# EAGLE design Sensors_v2 (EAGLE 9.3.1)
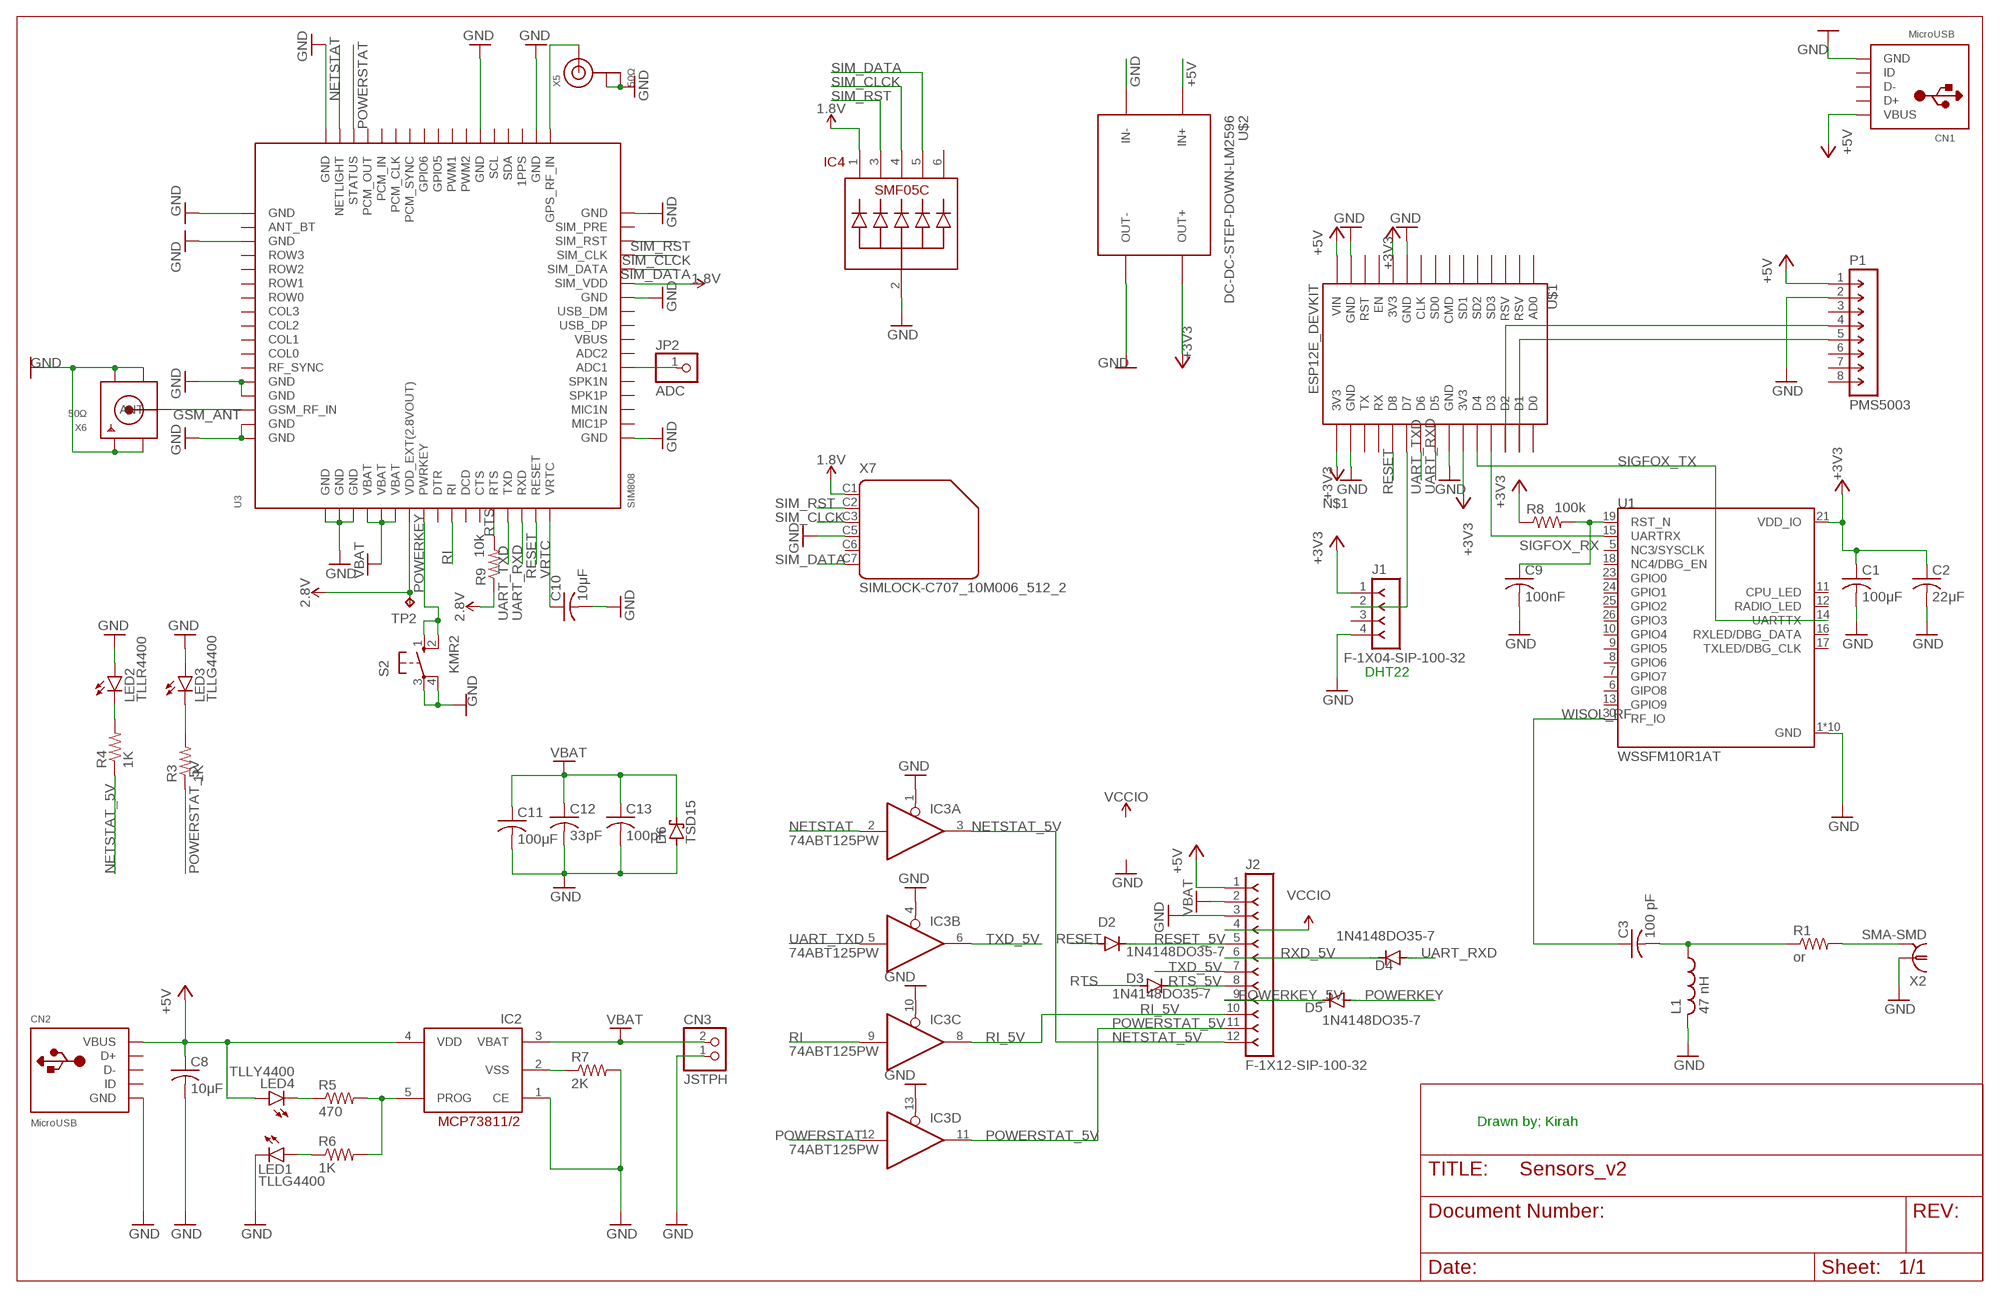
[diagram p0: schematic, sheet 1]

## Parts
C1  100μF  C-USC0201  [C0201]
C2  22μF  C-USC0201  [C0201]
C3  100 pF  C-USC0201  [C0201]
C8  10μF  C-US025-025X050  [C025-025X050]
C9  100nF  C-US025-025X050  [C025-025X050]
C10  10μF  C-USC0402  [C0402]
C11  100μF  C-USC0402  [C0402]
C12  33pF  C-USC0402  [C0402]
C13  100pF  C-USC0402  [C0402]
CN1  MicroUSB  USBMINIB  [USB-MINIB]
CN2  MicroUSB  USBMINIB  [USB-MINIB]
CN3  JSTPH  JST_2PIN-SMT  [JST-PH-2-SMT]
D2  1N4148DO35-7  [DO35-7]
D3  1N4148DO35-7  [DO35-7]
D4  1N4148DO35-7  [DO35-7]
D5  1N4148DO35-7  [DO35-7]
D6  TSD15  [CB429-15]
IC2  MCP73811/2  [SOT23-5L]
IC3  74ABT125PW  [TSSOP14]
IC4  SMF05C  [SC-70-6]
J1  F-1X04-SIP-100-32  [SIP-100-04-32]
J2  F-1X12-SIP-100-32  [SIP-100-12-32]
JP2  ADC  PINHD-1X01_2.00  [1X01M]
L1  47 nH  L-US0204/7  [0204/7]
LED1  TLLG4400  [LED3MM]
LED2  TLLR4400  [LED3MM]
LED3  TLLG4400  [LED3MM]
LED4  TLLY4400  [LED3MM]
P1  PMS5003  M-1X08-SIP-100-40  [SIP-100-08-40]
R1  or  R-US_0204/5  [0204/5]
R3  1K  R-US_0204/5  [0204/5]
R4  1K  R-US_0204/5  [0204/5]
R5  470  R-US_0204/5  [0204/5]
R6  1K  R-US_0204/5  [0204/5]
R7  2K  R-US_0204/5  [0204/5]
R8  100k  R-US_0204/7  [0204/7]
R9  10k  R-US_0204/5  [0204/5]
S2  KMR2  40/XX  [B3F/40XX]
TP2  TPTP10R  [TP10R]
U1  WSSFM10R1AT  [XCVR_WSSFM10R1AT]
U3  SIM808  GSM_SIM808_LITERAL  [SIM900_SMT]
U$1  ESP12E_DEVKIT  [ESP12E_DEVKIT]
U$2  DC-DC-STEP-DOWN-LM2596  [DC-DC-STEP-DOWN-LM2596]
X2  SMA-SMD  [SMA-SMD]
X5  50Ω  ANTENNA_U.FL  [U.FL]
X6  50Ω  SMACONNECTOR_EDGE_UFL  [SMA_EDGELAUNCH_UFL]
X7  SIMLOCK-C707_10M006_512_2  [C707_10M006_512_2]

## Nets
1.8V [POWER]: IC4.1 U3.P$29(SIM_VDD) X7.C1
2.8V [POWER]: R9.1 TP2.TP U3.P$7(VDD_EXT(2.8VOUT))
+3V3 [POWER]: C1.1 C2.1 J1.1 R8.1 U1.21(VDD_IO) U$1.3V3@0(3V3) U$1.3V3@1(3V3) U$1.3V3@2(3V3) U$2.OUT+
+5V [POWER]: C8.1 CN1.VBUS CN2.VBUS IC2.4(VDD) J2.1 LED4.A P1.1 U$1.VIN U$2.IN+
GND [GND]: C1.2 C2.2 C8.2 C9.2 C10.2 C11.2 C12.2 C13.2 CN1.GND CN2.GND CN3.1 D6.A IC2.1(CE) IC3.1(A:OE) IC3.4(B:OE) IC3.10(C:OE) IC3.13(D:OE) IC4.2 J1.4 J2.3 L1.2 LED1.K(C) LED2.A LED3.A P1.2 R7.2 S2.3(P) S2.4(P1) U1.1(GND) U1.2(GND) U1.3(GND) U1.4(GND) U1.20(GND) U1.22(GND) U1.27(GND) U1.28(GND) U1.29(GND) U1.31(GND) U3.P$1(GND) U3.P$2(GND) U3.P$3(GND) U3.P$18(GND) U3.P$28(GND) U3.P$34(GND) U3.P$36(GND) U3.P$40(GND) U3.P$51(GND) U3.P$52(GND) U3.P$54(GND) U3.P$64(GND) U3.P$65(GND) U3.P$67(GND) U3.P$68(GND) U$1.GND@0(GND) U$1.GND@1(GND) U$1.GND@2(GND) U$1.GND@3(GND) U$2.IN- U$2.OUT- X2.1 X5.1(GND) X5.2(GND) X6.GND@1(GND1) X6.GND@2(GND2) X6.GND@3(GND3) X6.GND@4(GND4) X7.C5
GSM_ANT: U3.P$66(GSM_RF_IN) X6.P(ANT)
N$1: J1.2 U$1.D7
N$2: C9.1 R8.2 U1.19(RST_N)
N$3: P1.4 U$1.D2
N$4: P1.5 U$1.D1
N$5: C3.2 L1.1 R1.1
N$6: U3.P$35(GPS_RF_IN) X5.3(SIGNAL)
N$12: R1.2 X2.2@1 X2.2@2 X2.2@3 X2.2@4 X2.2@5 X2.2@6
N$13: JP2.1 U3.P$23(ADC1)
N$18: LED2.K(C) R4.2
N$21: LED3.K(C) R3.2
N$35: LED4.K(C) R5.1
N$36: IC2.5(PROG) R5.2 R6.2
N$37: LED1.A R6.1
NETSTAT: IC3.2(A:I) U3.P$50(NETLIGHT)
NETSTAT_5V: IC3.3(A:O) J2.12 R4.1
POWERKEY: D5.A S2.1(S) S2.2(S1) U3.P$8(PWRKEY)
POWERKEY_5V: D5.C J2.9
POWERSTAT: IC3.12(D:I) U3.P$49(STATUS)
POWERSTAT_5V: IC3.11(D:O) J2.11 R3.1
RESET: D2.A U3.P$16(RESET) U$1.D8
RESET_5V: D2.C J2.5
RI: IC3.9(C:I) U3.P$10(RI)
RI_5V: IC3.8(C:O) J2.10
RTS: D3.A R9.2 U3.P$13(RTS)
RTS_5V: D3.C J2.8
RXD_5V: D4.C J2.6
SIGFOX_RX: U1.15(UARTRX) U$1.D3
SIGFOX_TX: U1.14(UARTTX) U$1.D4
SIM_CLCK: IC4.4 U3.P$31(SIM_CLK) X7.C3
SIM_DATA: IC4.5 U3.P$30(SIM_DATA) X7.C7
SIM_RST: IC4.3 U3.P$32(SIM_RST) X7.C2
TXD_5V: IC3.6(B:O) J2.7
UART_RXD: D4.A U3.P$15(RXD) U$1.D5
UART_TXD: IC3.5(B:I) U3.P$14(TXD) U$1.D6
VBAT: C11.1 C12.1 C13.1 CN3.2 D6.C IC2.3(VBAT) J2.2 U3.P$4(VBAT) U3.P$5(VBAT) U3.P$6(VBAT)
VCCIO: J2.4
VRTC: C10.1 U3.P$17(VRTC)
VSS: IC2.2(VSS) R7.1
WISOL_RF: C3.1 U1.30(RF_IO)
Unconnected: CN1.D+ CN1.D- CN1.ID CN2.D+ CN2.D- CN2.ID IC4.6 J1.3 P1.3 P1.6 P1.7 P1.8 U1.5(NC3/SYSCLK) U1.6(GIPO8) U1.7(GPIO7) U1.8(GPIO6) U1.9(GPIO5) U1.10(GPIO4) U1.11(CPU_LED) U1.12(RADIO_LED) U1.13(GPIO9) U1.16(RXLED/DBG_DATA) U1.17(TXLED/DBG_CLK) U1.18(NC4/DBG_EN) U1.23(GPIO0) U1.24(GPIO1) U1.25(GPIO2) U1.26(GPIO3) U3.P$9(DTR) U3.P$11(DCD) U3.P$12(CTS) U3.P$19(MIC1P) U3.P$20(MIC1N) U3.P$21(SPK1P) U3.P$22(SPK1N) U3.P$24(ADC2) U3.P$26(USB_DP) U3.P$27(USB_DM) U3.P$33(SIM_PRE) U3.P$37(1PPS) U3.P$38(SDA) U3.P$39(SCL) U3.P$41(PWM2) U3.P$42(PWM1) U3.P$43(GPIO5) U3.P$44(GPIO6) U3.P$45(PCM_SYNC) U3.P$46(PCM_CLK) U3.P$47(PCM_IN) U3.P$48(PCM_OUT) U3.P$53(ANT_BT) U3.P$55(ROW3) U3.P$56(ROW2) U3.P$57(ROW1) U3.P$58(ROW0) U3.P$59(COL3) U3.P$60(COL2) U3.P$61(COL1) U3.P$62(COL0) U3.P$63(RF_SYNC) U$1.AD0 U$1.CLK U$1.CMD U$1.D0 U$1.EN U$1.RST U$1.RSV@0(RSV) U$1.RSV@1(RSV) U$1.RX U$1.SD0 U$1.SD1 U$1.SD2 U$1.SD3 U$1.TX X7.C6

## Notes on the sheet
- DHT22
- Drawn by; Kirah

## Power pins joined to a net without a drawn wire
GND: IC3.7(P:GND)
VBUS: U3.P$25(VBUS)
VCC: IC3.14(P:VCC)

## Library data of the parts
C1-C3 C9-C13 = rcl:C-US: CAPACITOR, American symbol; SPICEPREFIX: C
C8 = adafruit@1:C-US: CAPACITOR, American symbol
CN1 = adafruit:USB: USB Connectors USBMINIB - Surface Mount Female Mini-B USB Connector 4UConnector: 06564 By microbuilder.eu Thru-hole RA Female Mini-B USB Connector 4UConnector: 18732 By ladyada.net
CN2 = adafruit@1:USB: USB Connectors USBMINIB - Surface Mount Female Mini-B USB Connector 4UConnector: 06564 By microbuilder.eu Thru-hole RA Female Mini-B USB Connector 4UConnector: 18732 By ladyada.net
CN3 = adafruit:JST_2PIN: JST 2-Pin Connectors of various flavors SMT-RA (S2B-PH-SM4) 4UConnector #17311 SMT (B2B-PH-SM4) THM-RA (S2B-PH) THM (B2B-PH)
D2-D5 = diode:1N4148: DIODE high speed (Philips)
D6 = diode:TSD15: DIODE
IC2 = adafruit:MCP73811/2: MCP73811 and MCP73812 Simple, Miniature Single-Cell, Fully Integrated Li-Ion / Li-Polymer Charge Management Controllers SOT-23-5 package, no indicator LED but with adjustable current, small and very inexpensive
IC3 = 74xx-eu:74*125: Quad bus BUFFER, 3-state
IC4 = smf05c:SMF05C
J1 = con-headers-jp:F-1X04-: FEMALE HEADER
J2 = con-headers-jp:F-1X12-: FEMALE HEADER
JP2 = pinhead-2:PINHD-1X01: PIN HEADER
L1 = rcl:L-US: INDUCTOR, American symbol; SPICEPREFIX: L
LED1 LED3 = led:TLLG4400: Low Current (2mA) LED 3 mm Tinted Diffused Package color GREEN Source: Data sheet <http://www.farnell.com/datasheets/391098.pdf>; MF: VISHAY SEMICONDUCTOR; OC_FARNELL: 1612435
LED2 = led:TLLR4400: Low Current (2mA) LED 3 mm Tinted Diffused Package color RED Source: Data sheet <http://www.farnell.com/datasheets/391100.pdf>; MF: VISHAY SEMICONDUCTOR; OC_FARNELL: 1612437
LED4 = led:TLLY4400: Low Current (2mA) LED 3 mm Tinted Diffused Package color YELLOW Source: Data sheet <http://www.farnell.com/datasheets/391098.pdf>; MF: VISHAY SEMICONDUCTOR; OC_FARNELL: 1612439
P1 = con-headers-jp:M-1X08-: MALE HEADER
R1 R3-R9 = rcl:R-US_: RESISTOR, American symbol; SPICEPREFIX: R
S2 = switch-omron:40/XX: OMRON SWITCH; OC_FARNELL: unknown; OC_NEWARK: unknown
TP2 = testpad:TP: Test pad
U1 = WSSFM10R1AT:WSSFM10R1AT: Sigfox RF Module, Sub-1GHz , SMD; AVAILABILITY: Unavailable; DESCRIPTION: Sigfox Module Rcz1 At Version; MF: Avnet Design Services; MP: WSSFM10R1AT; PACKAGE: None; PRICE: None
U3 = adafruit:GSM_SIM808_LITERAL: SIM808 GSM Module
U$1 = ESP12E_DEVKIT:ESP12E_DEVKIT: ESP12E DEVKIT BOARD
U$2 = diy-modules:DC-DC-STEP-DOWN-LM2596: DC/DC Step-Down Regulator based on LM2596-ADJ chip LM2596 datasheet available here: http://www.ti.com/lit/ds/symlink/lm2596.pdf Click here to find device on ebay.com <http://www.ebay.com/sch/lm2596+power+regulator>
X2 = con-coax:SMA-SMD: SMA 50 Ohm Straight Jack Receptacle - Surface Mount www.johnsoncomponents.com Source: http://catalog.digikey.com .. 142-0711-201, 205, 202, 206.pdf; OC_FARNELL: unknown; OC_NEWARK: unknown
X5 = adafruit:ANTENNA_U.FL: U.FL Antenna Connector
X6 = adafruit@1:SMACONNECTOR: SMA Connector 90° DIP SMA Connector, 50 Ohm (4UConnector: 07259)
X7 = con-amphenol:SIMLOCK-C707_10M006_512_2: C707A SIMLOCK® 2.5 mm with wide solder tails Source: Data sheet <http://www.amphenol.info/downloads/C707_10M006_512_2.pdf>; OC_FARNELL: unknown; OC_NEWARK: unknown

## Net classes
1 POWER: width 0.305 mm
2 GND: width 0.254 mm

## Board
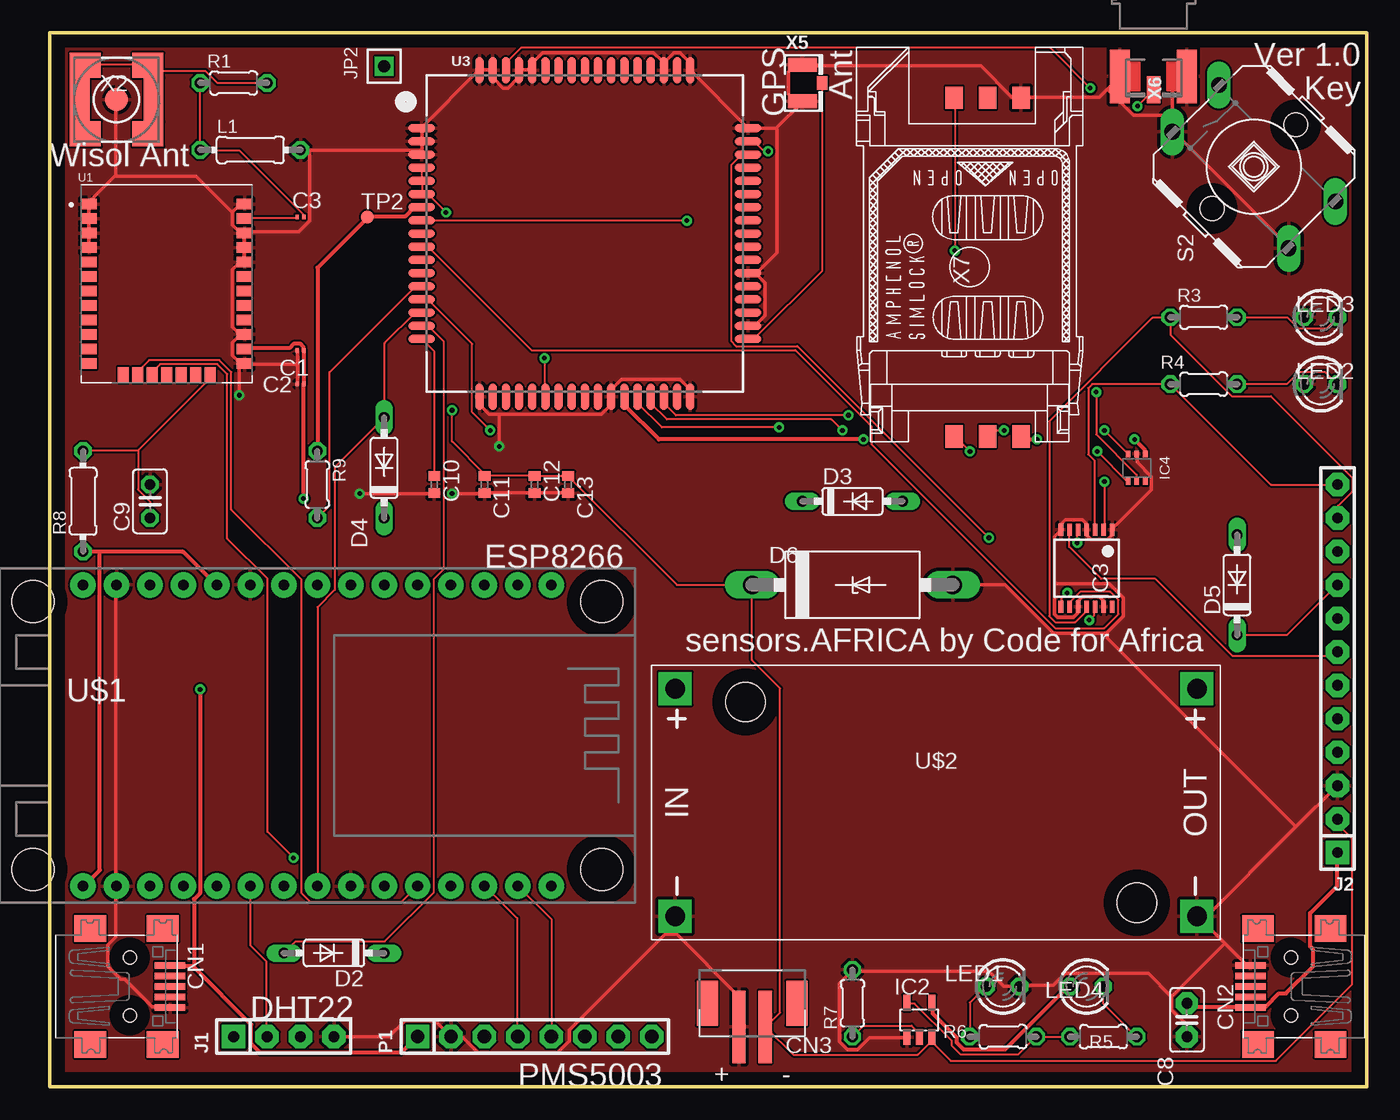
[diagram p1: board, top side]
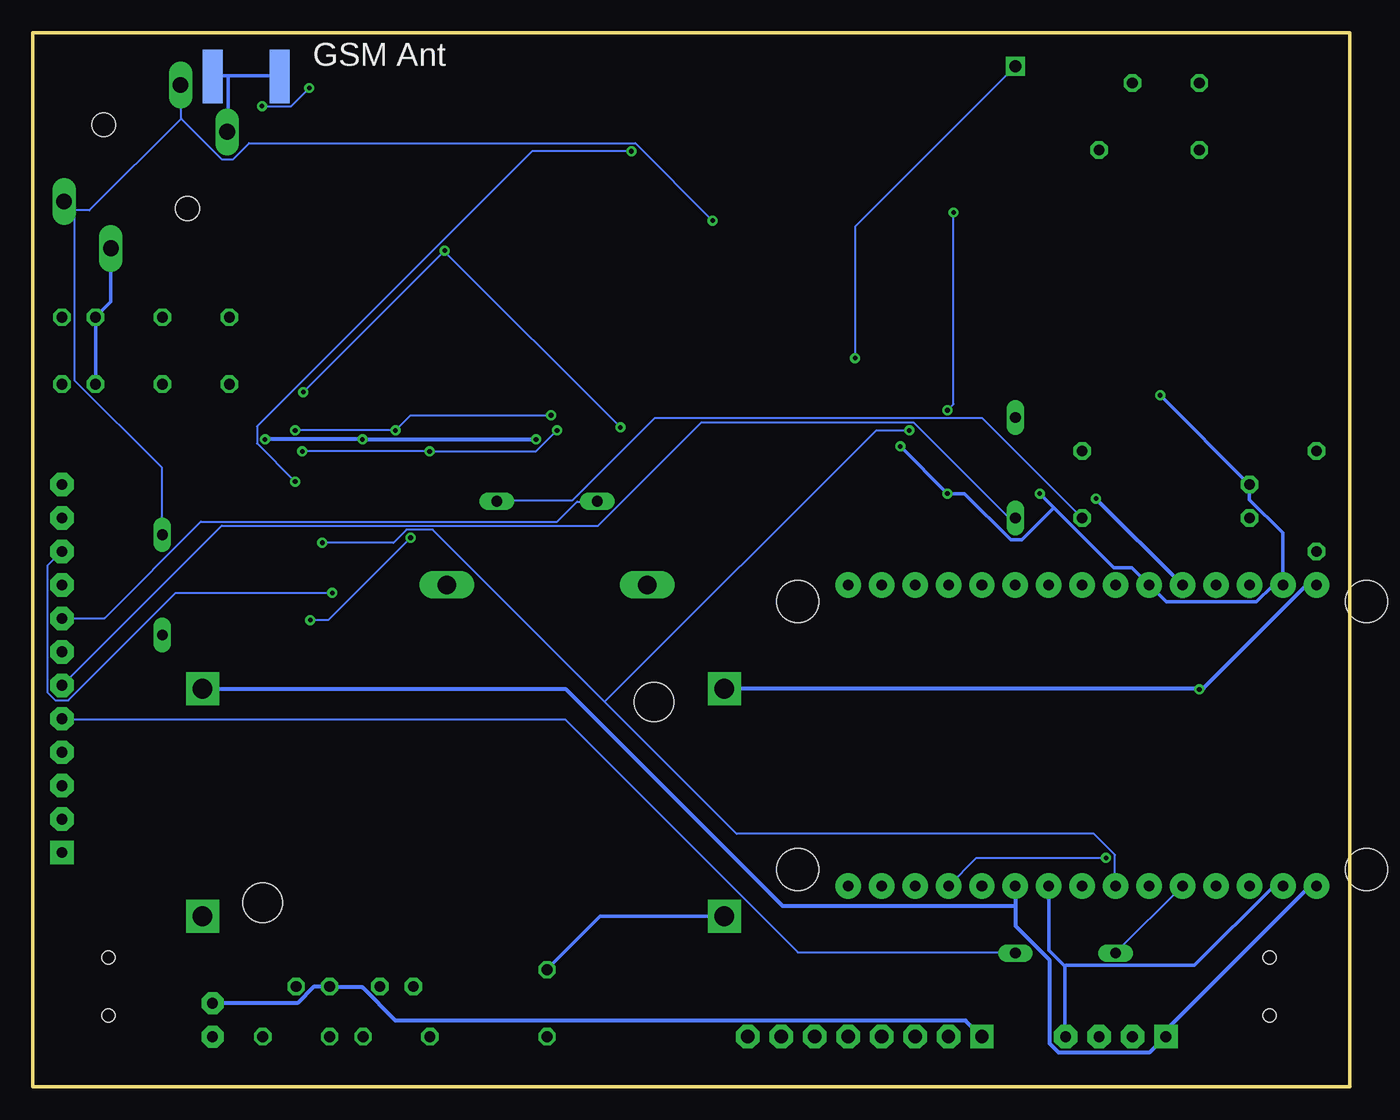
[diagram p2: board, bottom side, seen from below]

Size 100 x 80 mm. Coordinates in mm from the lower left corner, seen from the top.
Outline: 0,0 100,0 100,80 0,80 0,0
Copper layers (1*16): Top 0.035mm / dielectric 1.5mm / Bottom 0.035mm
Design rules "default": minimum track width 6mil, minimum drill 0.35mm, track to track 6mil, track to pad 6mil, pad to pad 6mil, via to via 6mil, smd to smd 6mil, copper to edge 40mil, drill to drill 6mil, minimum pad ring 10mil, minimum via ring 8mil, stop-mask expansion 4mil, vias tented up to drill 0mil, thermal gap 10mil

### Footprints (pad centres in the part's own frame; a part is rotated, then mirrored left to right if it is on the bottom)
C0201 = smd 0.25 x 0.35: 1 -0.25,0; 2 0.25,0
C025-025X050 = drill 0.813 pad 1.676 octagon: 1 -1.27,0; 2 1.27,0
C025-025X050' = drill 0.813 octagon: 1 -1.27,0; 2 1.27,0
C0402 = smd 0.7 x 0.9: 1 -0.65,0; 2 0.65,0
USB-MINIB = smd 0.5 x 2.308: D+ 0,4.064; D- -0.8,4.064; GND 1.6,4.064; ID 0.8,4.064; VBUS -1.6,4.064 | smd 2 x 2.4: GND1 -4.4,-2; GND2 -4.4,3.5; GND3 4.4,3.5; GND4 4.4,-2 | hole 1: -2.2,1; 2.2,1
JST-PH-2-SMT = smd 1 x 5.5: 1 -1,-1.8; 2 1,-1.8 | smd 1.6 x 3.4: NC1 -3.4,0; NC2 3.4,0
DO35-7 = drill 0.813 long: A 3.81,0; C -3.81,0
CB429-15 = drill 1.397 long: A 7.62,0; C -7.62,0
SOT23-5L = smd 0.55 x 1.2: 1 -0.95,-1.3; 2 0,-1.3; 3 0.95,-1.3; 4 0.95,1.3; 5 -0.95,1.3
TSSOP14 = smd 0.35 x 0.9: 1 -1.95,-2.925; 2 -1.3,-2.925; 3 -0.65,-2.925; 4 0,-2.925; 5 0.65,-2.925; 6 1.3,-2.925; 7 1.95,-2.925; 8 1.95,2.925; 9 1.3,2.925; 10 0.65,2.925; 11 0,2.925; 12 -0.65,2.925; 13 -1.3,2.925; 14 -1.95,2.925
SC-70-6 = smd 0.35 x 0.5: 1 -0.65,-1.05; 2 0,-1.05; 3 0.65,-1.05; 4 0.65,1.05; 5 0,1.05; 6 -0.65,1.05
SIP-100-04-32 = drill 0.813 pad 1.778 square: 1 -3.81,0 | drill 0.813 pad 1.778 octagon: 2 -1.27,0; 3 1.27,0; 4 3.81,0
SIP-100-12-32 = drill 0.813 pad 1.778 square: 1 -13.97,0 | drill 0.813 pad 1.778 octagon: 2 -11.43,0; 3 -8.89,0; 4 -6.35,0; 5 -3.81,0; 6 -1.27,0; 7 1.27,0; 8 3.81,0; 9 6.35,0; 10 8.89,0; 11 11.43,0; 12 13.97,0
1X01M = drill 0.914 square: 1 0,0
0204/7 = drill 0.813 octagon: 1 -3.81,0; 2 3.81,0
LED3MM = drill 0.813 octagon: A -1.27,0; K 1.27,0
SIP-100-08-40 = drill 1.016 pad 1.778 square: 1 -8.89,0 | drill 1.016 pad 1.778 octagon: 2 -6.35,0; 3 -3.81,0; 4 -1.27,0; 5 1.27,0; 6 3.81,0; 7 6.35,0; 8 8.89,0
0204/5 = drill 0.813 octagon: 1 -2.54,0; 2 2.54,0
B3F/40XX = drill 1.194 long: 1 -6.198,-2.642; 2 2.642,6.198; 3 -2.642,-6.198; 4 6.198,2.642 | hole 1.803: -3.175,3.175; 3.175,-3.175
TP10R = smd 1 x 1: TP 0,0
XCVR_WSSFM10R1AT = smd 1.15 x 0.81: 1 -5.9,6.05; 2 -5.9,4.95; 3 -5.9,3.85; 4 -5.9,2.75; 5 -5.9,1.65; 6 -5.9,0.55; 7 -5.9,-0.55; 8 -5.9,-1.65; 9 -5.9,-2.75; 10 -5.9,-3.85; 11 -5.9,-4.95; 12 -5.9,-6.05; 20 5.9,-6.05; 21 5.9,-4.95; 22 5.9,-3.85; 23 5.9,-2.75; 24 5.9,-1.65; 25 5.9,-0.55; 26 5.9,0.55; 27 5.9,1.65; 28 5.9,2.75; 29 5.9,3.85; 30 5.9,4.95; 31 5.9,6.05 | smd 0.81 x 1.15: 13 -3.3,-6.9; 14 -2.2,-6.9; 15 -1.1,-6.9; 16 0,-6.9; 17 1.1,-6.9; 18 2.2,-6.9; 19 3.3,-6.9
SIM900_SMT = smd 2 x 0.6: P$1 -12.4,8; P$2 -12.4,7; P$3 -12.4,6; P$4 -12.4,5; P$5 -12.4,4; P$6 -12.4,3; P$7 -12.4,2; P$8 -12.4,1; P$9 -12.4,0; P$10 -12.4,-1; P$11 -12.4,-2; P$12 -12.4,-3; P$13 -12.4,-4; P$14 -12.4,-5; P$15 -12.4,-6; P$16 -12.4,-7; P$17 -12.4,-8; P$35 12.4,-8; P$36 12.4,-7; P$37 12.4,-6; P$38 12.4,-5; P$39 12.4,-4; P$40 12.4,-3; P$41 12.4,-2; P$42 12.4,-1; P$43 12.4,0; P$44 12.4,1; P$45 12.4,2; P$46 12.4,3; P$47 12.4,4; P$48 12.4,5; P$49 12.4,6; P$50 12.4,7; P$51 12.4,8 | smd 0.6 x 2: P$18 -8,-12.4; P$19 -7,-12.4; P$20 -6,-12.4; P$21 -5,-12.4; P$22 -4,-12.4; P$23 -3,-12.4; P$24 -2,-12.4; P$25 -1,-12.4; P$26 0,-12.4; P$27 1,-12.4; P$28 2,-12.4; P$29 3,-12.4; P$30 4,-12.4; P$31 5,-12.4; P$32 6,-12.4; P$33 7,-12.4; P$34 8,-12.4; P$52 8,12.4; P$53 7,12.4; P$54 6,12.4; P$55 5,12.4; P$56 4,12.4; P$57 3,12.4; P$58 2,12.4; P$59 1,12.4; P$60 0,12.4; P$61 -1,12.4; P$62 -2,12.4; P$63 -3,12.4; P$64 -4,12.4; P$65 -5,12.4; P$66 -6,12.4; P$67 -7,12.4; P$68 -8,12.4
ESP12E_DEVKIT = drill 0.8 pad 1.93: 3V3@0 -11.43,-7.62; 3V3@1 11.43,5.08; 3V3@2 11.43,-17.78; AD0 -11.43,17.78; CLK -11.43,-2.54; CMD -11.43,2.54; D0 11.43,17.78; D1 11.43,15.24; D2 11.43,12.7; D3 11.43,10.16; D4 11.43,7.62; D5 11.43,0; D6 11.43,-2.54; D7 11.43,-5.08; D8 11.43,-7.62; EN -11.43,-10.16; GND@0 -11.43,-5.08; GND@1 -11.43,-15.24; GND@2 11.43,2.54; GND@3 11.43,-15.24; RST -11.43,-12.7; RSV@0 -11.43,15.24; RSV@1 -11.43,12.7; RX 11.43,-10.16; SD0 -11.43,0; SD1 -11.43,5.08; SD2 -11.43,7.62; SD3 -11.43,10.16; TX 11.43,-12.7; VIN -11.43,-17.78 | hole 3.2: -10.16,21.59; 10.16,21.59; 10.16,-21.59; -10.16,-21.59
DC-DC-STEP-DOWN-LM2596 = drill 1.5 pad 2.5 square: IN+ -19.812,8.636; IN- -19.812,-8.636; OUT+ 19.812,8.636; OUT- 19.812,-8.636 | hole 3: -14.478,7.62; 15.24,-7.62
SMA-SMD = smd 1.73 x 1.73: 1 0,0 | smd 2.35 x 1.9: 2@1 -2.375,2.6; 2@2 -2.375,-2.6; 2@3 2.375,-2.6; 2@4 2.375,2.6 | smd 1.5 x 3.4: 2@5 -2.8,0; 2@6 2.8,0
U.FL = smd 2.2 x 1.05: 1 0,1.375; 2 0,-1.375 | smd 0.8 x 1: 3 1.525,0
SMA_EDGELAUNCH_UFL = smd 4.064 x 1.524: GND@1 2.032,-2.54; GND@2 2.032,2.54 | smd 4.064 x 1.524 bottom: GND@3 2.032,2.54; GND@4 2.032,-2.54 | smd 2.032 x 1.016: P 3.048,0
C707_10M006_512_2 = smd 1.7 x 1.3: C1 -12.85,-3.915; C2 -12.85,-1.375; C3 -12.85,1.165; C5 12.85,-3.915; C6 12.85,-1.375; C7 12.85,1.165

### Placement (x,y rotation side)
C1  19.05,55.88 180 top
C2  19.05,53.34 180 top
C3  19.05,66.04 0 top
C8  86.36,5.08 270 top
C9  100nF  [C025-025X050']  7.62,44.45 90 top
C10  29.21,45.72 270 top
C11  33.02,45.72 270 top
C12  36.83,45.72 270 top
C13  39.37,45.72 270 top
CN1  5.08,7.62 270 top
CN2  95.25,7.62 90 top
CN3  53.34,6.35 0 top
D2  21.59,10.16 180 top
D3  60.96,44.45 0 top
D4  25.4,46.99 90 top
D5  90.17,38.1 90 top
D6  60.96,38.1 0 top
IC2  66.04,5.08 0 top
IC3  78.74,39.37 180 top
IC4  82.55,46.99 180 top
J1  17.78,3.81 0 top
J2  97.79,31.75 90 top
JP2  25.4,77.47 0 top
L1  15.24,71.12 0 top
LED1  72.39,7.62 0 top
LED2  96.52,53.34 0 top
LED3  96.52,58.42 0 top
LED4  78.74,7.62 0 top
P1  36.83,3.81 0 top
R1  13.97,76.2 0 top
R3  87.63,58.42 0 top
R4  87.63,53.34 0 top
R5  80.01,3.81 180 top
R6  72.39,3.81 0 top
R7  60.96,6.35 90 top
R8  2.54,44.45 90 top
R9  20.32,45.72 270 top
S2  91.44,69.85 270 top
TP2  24.13,66.04 0 top
U1  8.89,60.96 0 top
U3  40.64,64.77 0 top
U$1  20.32,26.67 270 top
U$2  67.31,21.59 0 top
X2  5.08,74.93 0 top
X5  57.15,76.2 0 top
X6  83.82,78.74 270 top
X7  69.85,62.23 90 top

### Tracks (layer width: path | path; a pad name or v marks a point on that pad's centre or on a via)
1.8V  (via drill 0.35)
  Top 0.305: v82.37,49.15 83.13,48.39 83.13,48.08 IC4.1 | v74.98,49.15 74.07,49.15 73.84,49.38 X7.C1 | v61.8,49.15 46.25,49.15 43.66,51.74 43.66,52.35 U3.P$29
  Bottom 0.305: v82.37,49.15 v74.98,49.15 v61.8,49.15
2.8V
  Top 0.305: U3.P$7 28.19,66.75 27.66,66.75 26.98,66.06 24.16,66.06 TP2.TP 24.08,65.91 20.34,62.18 20.34,48.31 R9.1
+3V3  (via drill 0.35)
  Top 0.305: U1.21 14.86,56.08 18.21,56.08 18.52,56.39 19.05,56.39 19.28,56.16 19.28,56.01 C1.1 19.28,55.85 19.28,53.34 C2.1 19.28,53.26 v19.28,44.65 | 3.81,40.62 10.13,40.62 12.65,38.1 U$1.3V3@0 | 3.81,40.62 2.59,40.62 R8.1 | 3.81,40.62 3.81,16.46 2.59,15.24 U$1.3V3@2
  Bottom 0.305: v19.28,44.65 12.72,38.1 U$1.3V3@0 | U$1.3V3@2 3.05,15.24 13.95,4.34 13.95,3.81 J1.1 14.1,3.73 15.24,2.59 22.1,2.59 22.78,3.28 22.78,9.6 25.38,12.19 25.38,13.72 | 25.38,13.72 25.38,15.24 U$1.3V3@1 | 25.38,13.72 43.05,13.72 59.51,30.18 87.1,30.18 U$2.OUT+
+5V  (via drill 0.35)
  Top 0.305: LED4.A 77.34,7.62 72.54,2.82 69.42,2.82 68.89,3.35 68.89,3.73 67.06,5.56 67.06,6.33 IC2.4 | C8.1 86.41,6.33 86.64,6.1 91.14,6.1 CN2.VBUS 91.29,6.1 92.35,6.1 93.34,7.09 93.88,7.09 95.94,9.14 95.94,10.44 95.71,10.67 95.71,13.18 97.77,15.24 97.77,17.75 J2.1 | 10.9,9.14 9.14,9.14 CN1.VBUS | 10.9,9.14 15.32,4.72 15.32,3.28 16,2.59 26.67,2.59 27.89,3.81 P1.1 | v11.43,30.18 11.43,14.71 10.97,14.25 10.97,9.22 10.9,9.14
  Bottom 0.305: C8.1 86.33,6.4 79.86,6.4 78.64,7.62 LED4.A 77.34,7.54 74.98,7.54 72.47,5.03 29.18,5.03 27.96,3.81 P1.1 | U$1.VIN 3.28,38.1 11.12,30.25 11.43,30.25 | 11.43,30.25 47.47,30.25 U$2.IN+ | v11.43,30.18 11.43,30.25
GND  (via drill 0.35)
  Top 0.254: X6.GND@4 80.31,75.74 | 80.31,75.74 79.7,75.13 73.84,75.13 X7.C5 73.69,75.13 73.08,75.13 70.71,77.5 57.23,77.5 X5.1 56.62,77.57 56.08,77.04 56.08,75.36 56.84,74.6 X5.2 57.15,74.75 55.17,72.77 | S2.3 85.27,72.54 85.27,75.59 86.33,76.66 X6.GND@3 | 80.31,75.74 82.3,73.76 85.19,73.76 S2.3 | S2.4 94.03,63.7 94.03,63.86 85.34,72.54 S2.3 | U3.P$36 53.11,57.84 53.65,57.84 54.33,58.52 54.33,61.04 53.65,61.72 53.11,61.72 U3.P$40 53.72,61.8 55.24,63.32 55.24,72.69 55.17,72.77 | 55.17,72.77 53.11,72.77 U3.P$51 52.96,72.85 48.69,77.11 U3.P$52 48.62,77.19 48.62,77.72 47.85,78.49 47.4,78.49 46.71,77.8 46.71,77.19 U3.P$54 46.63,77.88 46.48,77.88 45.87,78.49 37.41,78.49 36.73,77.8 36.73,77.27 U3.P$64 36.58,77.19 35.66,77.19 U3.P$65 35.59,77.11 35.59,76.58 34.82,75.82 34.44,75.82 33.68,76.58 33.68,77.11 U3.P$67 33.6,77.19 32.69,77.19 U3.P$68 32.54,77.11 28.27,72.85 U3.P$1 28.27,72.69 28.27,71.86 U3.P$2 28.27,71.7 28.27,71.09 | 28.27,71.09 28.27,70.79 U3.P$3 | 28.27,71.09 19.74,71.09 | 19.74,71.09 19.05,71.09 L1.2 | U1.4 2.97,63.78 2.97,64.77 U1.3 2.97,64.92 2.97,65.84 U1.2 2.97,65.99 2.97,66.98 U1.1 2.97,67.13 5.03,69.19 | 5.03,69.19 5.03,74.91 X2.1 | U1.29 14.78,64.77 14.78,63.78 U1.28 14.78,62.64 U1.27 14.71,62.56 14.4,62.56 13.87,62.03 13.87,57.68 14.4,57.15 U1.22 14.78,57.07 14.48,57.07 13.87,56.46 13.87,55.55 14.48,54.94 14.78,54.94 U1.20 | 13.87,66.37 14.48,66.98 14.78,66.98 U1.31 | 13.87,66.37 13.87,65.46 14.48,64.85 14.71,64.85 U1.29 | 18.82,54.86 18.82,55.85 C1.2 | 18.82,54.86 18.82,53.34 C2.2 | 18.82,54.86 14.86,54.86 U1.20 | 13.87,66.37 11.12,69.11 5.11,69.11 5.03,69.19
  Top 0.254: 19.74,71.09 19.74,65.76 18.9,64.92 14.86,64.92 U1.29 | CN1.GND 9.14,6.1 7.77,6.1 5.71,8.15 5.41,8.15 4.42,9.14 4.42,10.74 5.03,11.35 5.03,15.24 U$1.GND@3 5.03,15.32 5.03,38.1 U$1.GND@1 | J1.4 25.76,3.81 26.98,5.03 29.26,5.03 P1.2 30.56,3.73 31.39,3.73 32.54,2.59 38.56,2.59 39.47,3.5 39.47,4.34 46.71,11.58 47.47,11.58 47.55,11.66 | 34.14,51.05 41.91,51.05 42.6,51.74 42.6,52.35 U3.P$28 42.75,52.43 42.75,53.03 43.43,53.72 47.85,53.72 48.62,52.96 48.62,52.43 U3.P$34 | 34.14,51.05 33.38,51.05 32.69,51.74 32.69,52.35 U3.P$18 | C13.2 39.32,45.11 36.88,45.11 C12.2 36.8,45.11 33.07,45.11 C11.2 32.92,45.03 v30.56,45.03 | v23.55,45.03 29.18,45.03 C10.2 | v34.14,48.62 34.14,51.05 | IC4.2 82.6,48.01 82.6,47.4 83.67,46.33 83.67,45.34 80.7,42.37 IC3.1 80.62,42.22 80.62,41.83 80.31,41.53 79.1,41.53 78.79,41.83 78.79,42.22 IC3.4 78.72,42.37 78.72,42.75 78.41,43.05 77.11,43.05 76.81,42.75 76.81,42.37 IC3.7 76.73,42.22 76.28,41.76 76.28,38.18 | IC3.13 80.01,36.5 80.01,36.88 79.7,37.19 78.41,37.19 78.11,36.88 78.11,36.5 IC3.10 78.03,36.35 78.03,35.97 77.72,35.66 76.5,35.66 76.28,35.89 76.28,38.18 | D6.A 72.54,38.1 76.2,34.44 80.24,34.44 | 80.24,34.44 81.53,35.74 81.53,37.11 80.47,38.18 76.28,38.18 | 47.55,11.66 47.55,12.95 U$2.IN- | 47.55,11.66 52.27,6.93 52.27,4.57 CN3.1 | IC2.1 65.08,3.73 62.26,3.73 61.34,2.82 60.58,2.82 59.97,3.43 59.97,7.85 60.96,8.84 R7.2 61.04,8.76 71.32,8.76 72.47,7.62 LED1.K 73.76,7.7 76.2,7.7 77.11,8.61 83.44,8.61 85.19,6.86 | 89.23,10.9 87.17,12.95 U$2.OUT- 87.55,12.65 94.64,19.74 | 89.23,10.9 90.91,9.22 91.14,9.22 CN2.GND
  Top 0.254: 85.19,6.86 85.19,5.87 86.33,4.72 86.33,3.81 C8.2 | 89.23,10.9 85.19,6.86 | 94.64,19.74 97.77,22.86 J2.3 | 94.64,19.74 80.31,34.06 80.31,34.37 80.24,34.44 | v14.4,52.5 14.4,54.86 U1.20
  Bottom 0.254: LED2.A LED3.A 95.17,58.52 94.11,59.59 94.11,63.63 S2.4 | 85.19,76.73 86.33,76.73 X6.GND@3 | 85.19,76.73 81.31,76.73 X6.GND@4 | 85.19,76.73 85.19,72.54 S2.3 | U$1.GND@2 22.86,10.36 21.64,9.14 | 21.64,9.14 21.64,3.81 J1.4 | U$1.GND@3 5.79,15.24 11.81,9.22 21.57,9.22 21.64,9.14 | 22.48,43.97 17.91,39.4 16.54,39.4 U$1.GND@0 13.95,36.8 7.09,36.8 5.87,38.02 5.18,38.02 U$1.GND@1 5.11,38.1 5.11,42.06 7.62,44.58 C9.2 v14.4,52.5 | 22.48,43.97 v23.55,45.03 | 22.48,43.97 24.92,41.53 25.76,41.53 29.26,45.03 v30.56,45.03 v34.14,48.62 | U$2.IN- 56.92,12.95 60.96,8.91 R7.2
  pour Top: 0,0 0,80.01 100.33,80.01 100.33,0
GSM_ANT  (via drill 0.35)
  Top 0.152: v79.02,75.82 75.97,78.87 35.81,78.87 34.67,77.72 34.67,77.19 U3.P$66 | v82.6,74.45 83.82,75.67 X6.P
  Bottom 0.152: v79.02,75.82 80.39,74.45 v82.6,74.45
N$1
  Top 0.152: U$1.D7 15.24,10.74 16.46,9.53 16.46,3.81 J1.2
N$2
  Top 0.152: 6.71,48.31 12.12,53.72 12.12,54.03 U1.19 | 6.71,48.31 2.59,48.31 R8.2 | C9.1 7.62,44.42 6.71,45.34 6.71,48.31
N$3
  Top 0.152: P1.4 35.51,3.81 35.51,12.8 33.07,15.24 U$1.D2
N$4
  Top 0.152: P1.5 38.1,12.72 35.59,15.24 U$1.D1
N$5
  Top 0.152: C3.2 19.28,66.06 19.28,66.22 14.4,71.09 11.43,71.09 L1.1 R1.1
N$6
  Top 0.152: X5.3 58.67,61.95 53.57,56.84 53.11,56.84 U3.P$35
N$12
  Top 0.152: X2.2@2 2.67,72.39 2.67,74.52 2.29,74.91 X2.2@5 2.29,74.98 2.67,75.36 2.67,77.5 X2.2@1 2.74,77.57 7.39,77.57 X2.2@4 | X2.2@3 7.47,72.39 7.47,74.52 7.85,74.91 X2.2@6 7.85,74.98 7.47,75.36 7.47,77.11 | 7.47,77.11 7.47,77.5 X2.2@4 | R1.2 12.72,76.2 11.81,77.11 7.47,77.11 | 7.47,77.11 X2.2@4
N$13  (via drill 0.35)
  Top 0.152: v37.57,55.32 37.57,52.43 U3.P$23
  Bottom 0.152: v37.57,55.32 37.57,65.3 JP2.1
N$18
  Top 0.152: R4.2 93.95,53.34 94.87,54.25 96.85,54.25 97.77,53.34 LED2.K
N$21
  Top 0.152: R3.2 90.22,58.37 94.03,58.37 94.87,57.53 96.93,57.53 97.77,58.37 LED3.K
N$35
  Top 0.152: LED4.K 80.01,6.33 82.53,3.81 R5.1
N$36
  Top 0.152: IC2.5 65.15,6.33 65.68,6.33 68.5,3.5 68.5,3.12 69.19,2.44 73.53,2.44 74.91,3.81 R6.2 R5.2
N$37
  Top 0.152: R6.1 69.88,3.81 69.88,6.4 71.09,7.62 LED1.A
NETSTAT  (via drill 0.35)
  Top 0.152: v80.09,45.95 80.09,42.37 IC3.2 | v54.56,71.02 54.25,71.02 53.57,71.7 53.11,71.7 U3.P$50
  Bottom 0.152: v80.09,45.95 82.98,48.84 82.98,50.14 62.1,71.02 v54.56,71.02
NETSTAT_5V
  Top 0.152: IC3.3 79.32,42.37 79.32,47.55 78.87,48.01 78.87,53.03 79.17,53.34 R4.1 85.11,53.34 92.73,45.72 J2.12
POWERKEY  (via drill 0.35)
  Top 0.152: v48.39,65.76 28.27,65.76 U3.P$8
  Bottom 0.152: D5.A 90.22,41.91 90.22,47.02 96.85,53.65 96.85,66.45 97.61,67.21 S2.2 96.85,66.52 95.71,66.52 88.73,73.5 | v48.39,65.76 54.25,71.63 83.59,71.63 84.81,70.41 85.65,70.41 88.73,73.5 | 88.73,73.5 88.77,73.53 88.77,76.05 S2.1
POWERKEY_5V
  Top 0.152: D5.C 93.95,34.29 97.77,38.1 J2.9
POWERSTAT  (via drill 0.35)
  Top 0.152: v78.94,35.43 79.32,35.81 79.32,36.42 IC3.12 | v71.32,41.68 56.77,56.24 52.12,56.24 51.74,56.62 51.74,69.95 52.5,70.71 53.03,70.71 U3.P$49
  Bottom 0.152: v78.94,35.43 77.57,35.43 v71.32,41.68
POWERSTAT_5V
  Top 0.152: IC3.11 78.72,36.42 78.72,36.12 77.88,35.28 76.35,35.28 75.89,35.74 75.89,50.52 83.74,58.37 85.04,58.37 R3.1 85.11,58.37 85.11,57.07 89.76,52.43 92.73,52.43 98.91,46.25 98.91,45.19 97.84,44.12 97.84,43.2 J2.11
RESET
  Top 0.152: D2.A 18.67,11.05 25.45,11.05 29.18,14.78 29.18,38.56 29.95,39.32 29.95,56.54 28.73,57.76 28.27,57.76 U3.P$16
  Bottom 0.152: U$1.D8 12.72,15.24 17.75,10.21 D2.A
RESET_5V
  Bottom 0.152: D2.C 25.45,10.21 41.91,10.21 59.59,27.89 97.77,27.89 J2.5
RI
  Top 0.152: IC3.9 77.5,36.5 77.5,36.8 78.26,37.57 80.54,37.57 81.15,36.96 81.15,35.89 80.09,34.82 76.35,34.82 62.41,48.77 62.41,50.14 56.62,55.93 36.58,55.93 28.8,63.7 28.27,63.7 U3.P$10
RI_5V  (via drill 0.35)
  Top 0.152: v77.27,37.49 76.81,37.03 76.81,36.5 IC3.8
  Bottom 0.152: v77.27,37.49 89.15,37.49 97.31,29.34 98.3,29.34 98.91,29.95 98.91,39.55 97.84,40.62 J2.10
RTS
  Top 0.152: R9.2 21.26,44.12 21.26,54.25 27.74,60.73 28.19,60.73 U3.P$13
  Bottom 0.152: R9.2 27.89,50.75 52.81,50.75 59.05,44.5 64.77,44.5 D3.A
RTS_5V
  Bottom 0.152: D3.C 57.15,44.42 58.67,44.42 60.2,42.9 87.25,42.9 94.56,35.59 97.77,35.59 J2.8
RXD_5V
  Bottom 0.152: D4.C 25.45,43.2 25.91,43.2 33.15,50.44 49.23,50.44 57.07,42.6 85.65,42.6 97.77,30.48 J2.6
SIGFOX_RX  (via drill 0.35)
  Top 0.152: v18.52,17.37 16.54,19.36 16.54,38.56 13.49,41.6 13.49,54.1 12.72,54.86 8.38,54.86 7.85,54.33 7.85,54.1 U1.15
  Bottom 0.152: v18.52,17.37 28.35,17.37 U$1.D3
SIGFOX_TX
  Top 0.152: U1.14 6.71,54.1 6.71,54.33 7.54,55.17 12.88,55.17 13.79,54.25 13.79,43.81 19.13,38.48 19.13,14.71 19.81,14.02 26.67,14.02 27.89,15.24 U$1.D4
SIM_CLCK  (via drill 0.35)
  Top 0.152: v79.55,48.23 81.84,45.95 IC4.4 | v69.88,48.23 68.73,49.38 X7.C3 | v60.2,49.84 59.36,50.67 46.86,50.67 45.64,51.89 45.64,52.35 U3.P$31
  Bottom 0.152: v79.55,48.23 v69.88,48.23 61.8,48.23 v60.2,49.84
SIM_DATA  (via drill 0.35)
  Top 0.152: v79.48,52.73 79.48,49.53 82.53,46.48 82.53,45.95 IC4.5 | v68.73,63.48 68.73,75.06 X7.C7 | v55.4,50.06 46.48,50.06 44.65,51.89 44.65,52.35 U3.P$30
  Bottom 0.152: v79.48,52.73 v68.73,63.48 68.73,63.4 v55.4,50.06
SIM_RST  (via drill 0.35)
  Top 0.152: v80.09,49.84 81.84,48.08 IC4.3 | v72.47,49.84 71.63,49.84 71.25,49.45 X7.C2 | v60.66,50.98 47.55,50.98 46.71,51.82 46.71,52.35 U3.P$32
  Bottom 0.152: v80.09,49.84 v72.47,49.84 71.32,50.98 v60.66,50.98
TXD_5V
  Top 0.152: J2.7 97.46,32.69 89.84,32.69 83.97,38.56 79.86,38.56 77.42,41 77.42,42.29 IC3.6
UART_RXD
  Top 0.152: U3.P$15 28.19,58.75 27.74,58.75 25.45,56.46 25.45,50.83 D4.A 25.38,50.75 21.64,47.02 21.64,37.72 20.34,36.42 20.34,15.24 U$1.D5
UART_TXD  (via drill 0.35)
  Top 0.152: v78.03,41.3 78.03,42.29 IC3.5 | v33.45,49.84 32.08,51.21 32.08,56.39 28.73,59.74 28.27,59.74 U3.P$14
  Bottom 0.152: v78.03,41.3 72.62,41.3 71.63,42.29 69.65,42.29 56.58,29.22 | 56.58,29.22 46.56,19.2 19.43,19.2 17.83,17.6 17.83,15.24 U$1.D6 | v33.45,49.84 35.97,49.84 56.58,29.22
VBAT  (via drill 0.35)
  Top 0.152: U3.P$4 28.27,69.72 28.27,68.81 U3.P$5 28.27,68.73 28.27,67.82 U3.P$6 28.35,67.82 28.65,67.82 v30.1,66.37 | v30.56,51.36 30.56,49 33.07,46.48 C11.1 33.07,46.41 36.8,46.41 C12.1 36.88,46.41 39.32,46.41 C13.1 39.4,46.33 47.62,38.1 D6.C 53.34,32.38 55.47,30.25 55.47,5.64 54.41,4.57 CN3.2 54.41,4.5 56.46,2.44 65.91,2.44 66.98,3.5 66.98,3.73 IC2.3 66.98,3.43 68.43,1.98 93.12,1.98 98.91,7.77 98.91,18.82 97.84,19.89 97.84,20.27 J2.2
  Bottom 0.152: v30.1,66.37 30.1,51.82 v30.56,51.36
VRTC
  Top 0.152: C10.1 29.18,46.41 29.18,55.85 28.27,56.77 U3.P$17
VSS
  Top 0.152: R7.1 61.8,4.65 65.46,4.65 65.99,4.12 65.99,3.81 IC2.2
WISOL_RF
  Top 0.152: C3.1 18.75,65.99 14.94,65.99 14.86,65.91 U1.30

### Text on the board
tPlace: Ver 1.0 | Ant | Key | GPS | Wisol Ant | ESP8266 | sensors.AFRICA by Code for Africa | DHT22 | PMS5003
bPlace: GSM Ant